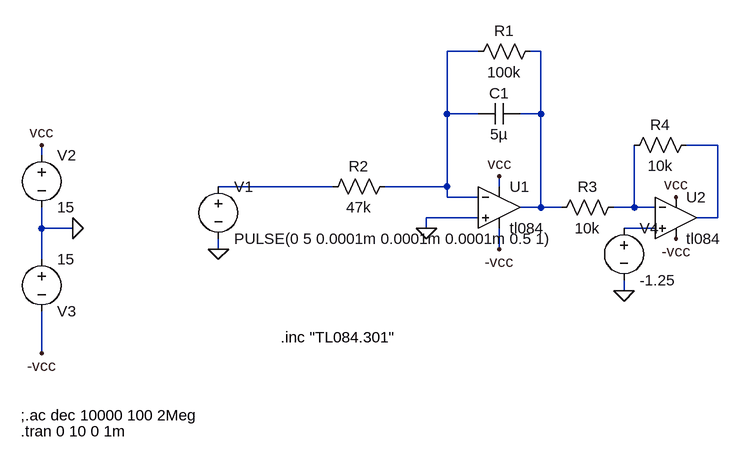
[diagram p0: schematic gyrator.asc]
gyrator.asc, the LTspice schematic file:
Version 4
SHEET 1 1092 680
WIRE 496 -128 448 -128
WIRE 592 -128 576 -128
WIRE 448 -32 448 -128
WIRE 496 -32 448 -32
WIRE 592 -32 592 -128
WIRE 592 -32 560 -32
WIRE 864 16 816 16
WIRE -176 32 -176 16
WIRE 272 80 96 80
WIRE 448 80 448 -32
WIRE 448 80 352 80
WIRE 528 80 528 64
WIRE 448 96 448 80
WIRE 496 96 448 96
WIRE 592 112 592 -32
WIRE 592 112 560 112
WIRE 624 112 592 112
WIRE 736 112 736 16
WIRE 736 112 704 112
WIRE 768 112 736 112
WIRE 496 128 416 128
WIRE 864 128 864 16
WIRE 864 128 832 128
WIRE -176 144 -176 112
WIRE -128 144 -176 144
WIRE 416 144 416 128
WIRE 768 144 720 144
WIRE 96 176 96 160
WIRE 528 176 528 144
WIRE -176 192 -176 144
WIRE 720 240 720 224
WIRE -176 336 -176 272
FLAG -128 144 0
FLAG -176 16 vcc
FLAG -176 336 -vcc
FLAG 800 96 vcc
FLAG 800 160 -vcc
FLAG 416 144 0
FLAG 528 64 vcc
FLAG 528 176 -vcc
FLAG 96 176 0
FLAG 720 240 0
SYMBOL Opamps\\opamp2 528 48 R0
SYMATTR InstName U1
SYMATTR Value tl084
SYMBOL voltage -176 16 R0
WINDOW 123 0 0 Left 0
WINDOW 39 0 0 Left 0
SYMATTR InstName V2
SYMATTR Value 15
SYMBOL voltage -176 176 R0
WINDOW 0 24 96 Left 2
WINDOW 3 24 16 Left 2
WINDOW 123 0 0 Left 0
WINDOW 39 0 0 Left 0
SYMATTR InstName V3
SYMATTR Value 15
SYMBOL cap 560 -48 R90
WINDOW 0 0 32 VBottom 2
WINDOW 3 32 32 VTop 2
SYMATTR InstName C1
SYMATTR Value 5µ
SYMBOL res 592 -144 R90
WINDOW 0 0 56 VBottom 2
WINDOW 3 32 56 VTop 2
SYMATTR InstName R1
SYMATTR Value 100k
SYMBOL res 368 64 R90
WINDOW 0 0 56 VBottom 2
WINDOW 3 32 56 VTop 2
SYMATTR InstName R2
SYMATTR Value 47k
SYMBOL Opamps\\opamp2 800 64 R0
SYMATTR InstName U2
SYMATTR Value tl084
SYMBOL res 720 96 R90
WINDOW 0 0 56 VBottom 2
WINDOW 3 32 56 VTop 2
SYMATTR InstName R3
SYMATTR Value 10k
SYMBOL res 832 0 R90
WINDOW 0 0 56 VBottom 2
WINDOW 3 32 56 VTop 2
SYMATTR InstName R4
SYMATTR Value 10k
SYMBOL voltage 96 64 R0
WINDOW 123 0 0 Left 0
WINDOW 39 0 0 Left 0
SYMATTR InstName V1
SYMATTR Value PULSE(0 5 0.0001m 0.0001m 0.0001m 0.5 1)
SYMBOL voltage 720 128 R0
WINDOW 123 0 0 Left 0
WINDOW 39 0 0 Left 0
SYMATTR InstName V4
SYMATTR Value -1.25
TEXT 192 312 Left 2 !.inc "TL084.301"
TEXT -208 432 Left 2 !;.ac dec 10000 100 2Meg
TEXT -208 456 Left 2 !.tran 0 10 0 1m

The netlist it stands for:
* gyrator.asc
XU1 0 N001 vcc -vcc N002 tl084  ; pins In+ In- V+ V- OUT
V2 vcc 0 15
V3 0 -vcc 15
C1 N002 N001 5µ
R1 N002 N001 100k
R2 N001 N004 47k
XU2 N006 N005 vcc -vcc N003 tl084  ; pins In+ In- V+ V- OUT
R3 N005 N002 10k
R4 N003 N005 10k
V1 N004 0 PULSE(0 5 0.0001m 0.0001m 0.0001m 0.5 1)
V4 N006 0 -1.25
.inc "TL084.301"
;.ac dec 10000 100 2Meg
.tran 0 10 0 1m
.backanno
.end